# Altium schematic sheet Modular_S2G1_Pinout_Diagram_Connectors_V1.SchDoc: <Project Name>
size A3; ApprovedBy: <Appr.>; Author: <Author>; CompanyName: Infineon Technologies AG; Engineer: <Rel.>; Organization: Infineon Technologies AG; Address1: IFAG DES S PS; Address2: Am Campeon 1-12  -  85579 Neubiberg  -  Germany; Address3: 85579 Neubiberg; Address4: Germany; Revision: <Rev.>; Release: RC00; PageSetup: Record=PageOptions|CenterHorizontal=True|CenterVertical=True|PrintScale=1.01|XCorrection=1.00|YCorrection=1.00|PrintKind=0|BorderSize=5000000|LeftOffset=0|BottomOffset=0|Orientation=2|PaperLength=1000|PaperWidth=1000|Scale=100|PaperSource=7|PrintQuality=-4|MediaType=1|DitherType=10|PaperKind=A3|PrintScaleMode=1; Doc_ConfidentialStatus: <Doc_ConfidentialStatus>; Doc_Preliminary: <Doc_Preliminary>
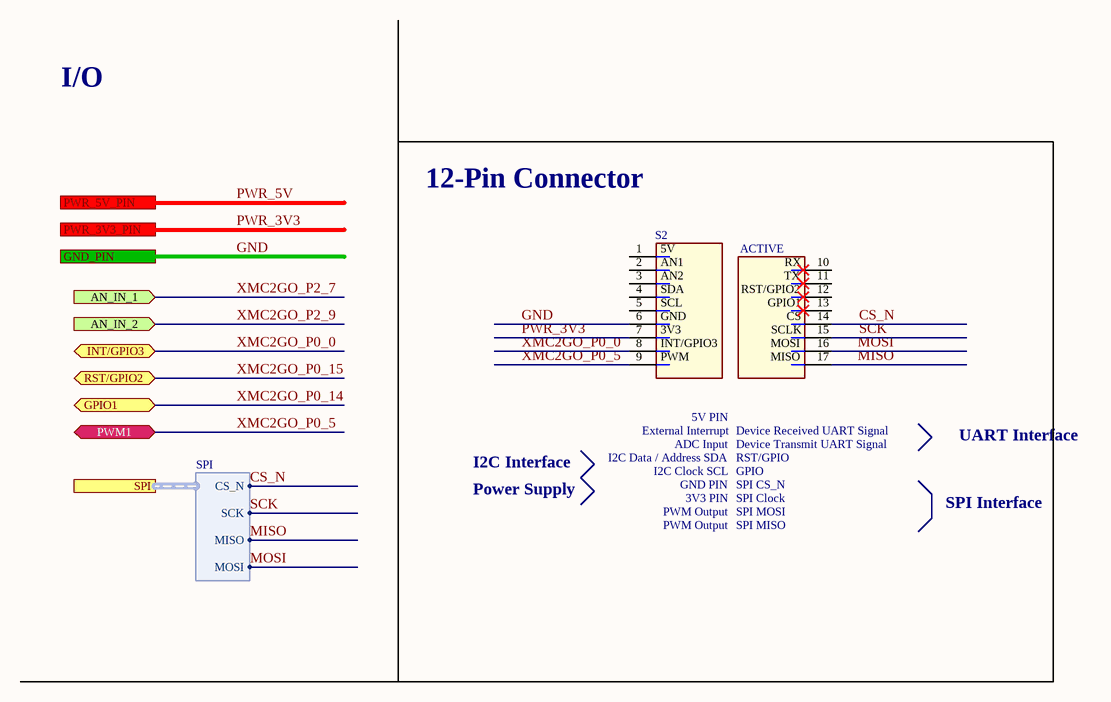
[diagram p0: Modular_S2G1_Pinout_Diagram_Connectors_V1.SchDoc]

## Parts
S2  (no value)  [Modular_S2G1_A]  (no BOM)

## Ports
AN_IN_1 (in), AN_IN_2 (in), GND_PIN, GPIO1 (bidir), INT/GPIO3 (bidir), PWM1 (bidir), PWR_3V3_PIN, PWR_5V_PIN, RST/GPIO2 (bidir), SPI (harness SPI)

## Harnesses
SPI: CS_N, MISO, MOSI, SCK

## Nets
CS_N: S2.14 ; port SPI.CS_N
GND: S2.6 ; port GND_PIN
MISO: S2.17 ; port SPI.MISO
MOSI: S2.16 ; port SPI.MOSI
PWR_3V3: S2.7 ; port PWR_3V3_PIN
PWR_5V: port PWR_5V_PIN
SCK: S2.15 ; port SPI.SCK
XMC2GO_P0_0: S2.8 ; port INT/GPIO3
XMC2GO_P0_5: S2.9 ; port PWM1
XMC2GO_P0_14: port GPIO1
XMC2GO_P0_15: port RST/GPIO2
XMC2GO_P2_7: port AN_IN_1
XMC2GO_P2_9: port AN_IN_2

Not connected (* = marked no-connect by the designer): S2 1 2 3 4 5 10 11 12 13

## Notes on the sheet
- I/O
- 12-Pin Connector
- External Interrupt
- (near S2) 5V PIN
- Device Received UART Signal
- UART Interface
- I2C Interface
- Power Supply
- I2C Data / Address SDA
- I2C Clock SCL
- ADC Input
- GND PIN
- 3V3 PIN
- Device Transmit UART Signal
- RST/GPIO
- GPIO
- SPI CS_N
- SPI Clock
- PWM Output
- SPI MOSI
- SPI MISO
- SPI Interface
- Title
- Variant
- Approved
- Date:
- Author:
- Size:
- A3
- Document Name
- Time:
- SVN Revision:
- Rel.
- Rev.
- Sheet
- of
- (in symbol ModularIFX_S2G_1A) 5V; ACTIVE; AN1; RX; AN2; TX; SDA; RST/GPIO2; SCL; GPIO1; GND; CS; 3V3; SCLK; INT/GPIO3; MOSI; PWM; MISO

## Library data of the parts
S2 = ModularIFX_S2G_1A: 17 Pin Active Connector S2G1 Modular Boards.; Manufacturer: Infineon Technologies; AutomotiveQualified: no; ComponentName: S2G_1A; ComponentStatus: Released; ComponentHeight: 0mm; ComponentLink1Description: Vendor WebSite; ComponentLink1URL: http://www.infineon.com; ComponentLink2Description: Datasheet; Manufacturer Component Status: Active